# Altium schematic sheet 01-POWER-FILTER.SchDoc
size A4
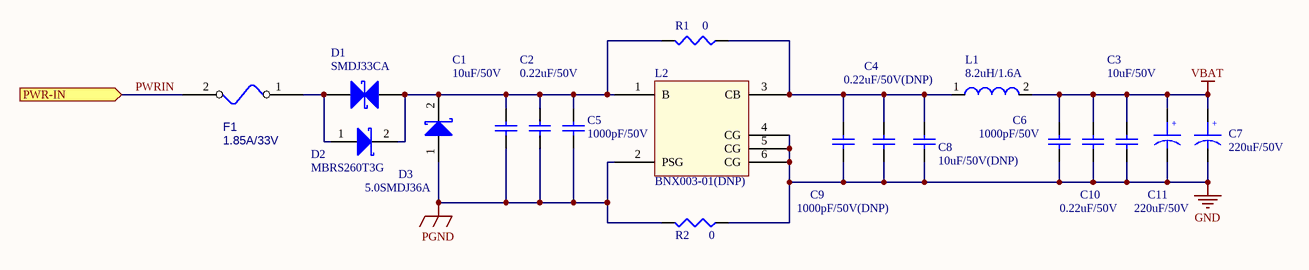
[diagram p0: 01-POWER-FILTER.SchDoc]

## Parts
C1  10uF/50V  [1210]
C2  0.22uF/50V  [0603]
C3  10uF/50V  [1210]
C4  0.22uF/50V(DNP)  [0603]
C5  1000pF/50V  [0402]
C6  1000pF/50V  [0402]
C7  220uF/50V  [DL-10*10.5]
C8  10uF/50V(DNP)  [1210]
C9  1000pF/50V(DNP)  [0402]
C10  0.22uF/50V  [0603]
C11  220uF/50V  [DL-10*10.5]
D1  SMDJ33CA  [SMC]
D2  MBRS260T3G  [SMB]
D3  5.0SMDJ36A  [SMC]
F1  1.85A/33V  [2920]
L1  8.2uH/1.6A  [IND-SMD-5.8*5.8]
L2  BNX003-01(DNP)  [BNX002-001]
R1  0  [1812]
R2  0  [1812]

## Ports
PWR-IN (in)

## Nets
GND: C3.2 C4.2 C6.2 C7.2 C8.2 C9.2 C10.2 C11.2 L2.4(CG) L2.5(CG) L2.6(CG) R2.1
PGND: C1.2 C2.2 C5.2 D3.1(A) L2.2(PSG) R2.2
VBAT: C3.1 C6.1 C7.1 C10.1 C11.1 L1.2
PWRIN: F1.2 ; port PWR-IN
NetC1_1: C1.1 C2.1 C5.1 D1.2 D2.2(K) D3.2(K) L2.1(B) R1.2
NetC4_1: C4.1 C8.1 C9.1 L1.1 L2.3(CB) R1.1
NetD1_1: D1.1 D2.1(A) F1.1

## Notes on the sheet
- (in symbol CAP WP) +

## Library data of the parts
C1-C6 C8-C10 = Cap: Capacitor; Published: 8-Jun-2000; LatestRevisionDate: 17-Jul-2002; LatestRevisionNote: Re-released for DXP Platform.; PackageReference: RAD-0.3; Publisher: Altium Limited; PackageDescription: Radial Cap, Thru-Hole; 2 Leads; 0.3 in Pin Spacing
C7 C11 = CAP WP
D1 = TVS-BI
D2 D3 = Diode 11DQ03: Schottky Rectifier
F1 = 2A_32VDC_0467-002
L1 = 4.7UH_CDH2D09BNP-4R7MC_0.7A_20%: Part Number: SH00000AJ00; ROOM: +1.3V_CORE
L2 = BNX002-01
R1 R2 = Res3: Resistor; Value: 1K; Published: 8-Jun-2000; LatestRevisionDate: 29-May-2009; LatestRevisionNote: IPC-7351 Footprint Added.; PackageReference: J1-0603; Publisher: Altium Limited; PackageDescription: Chip Resistor